# Altium project PCB_Project.PrjPcb
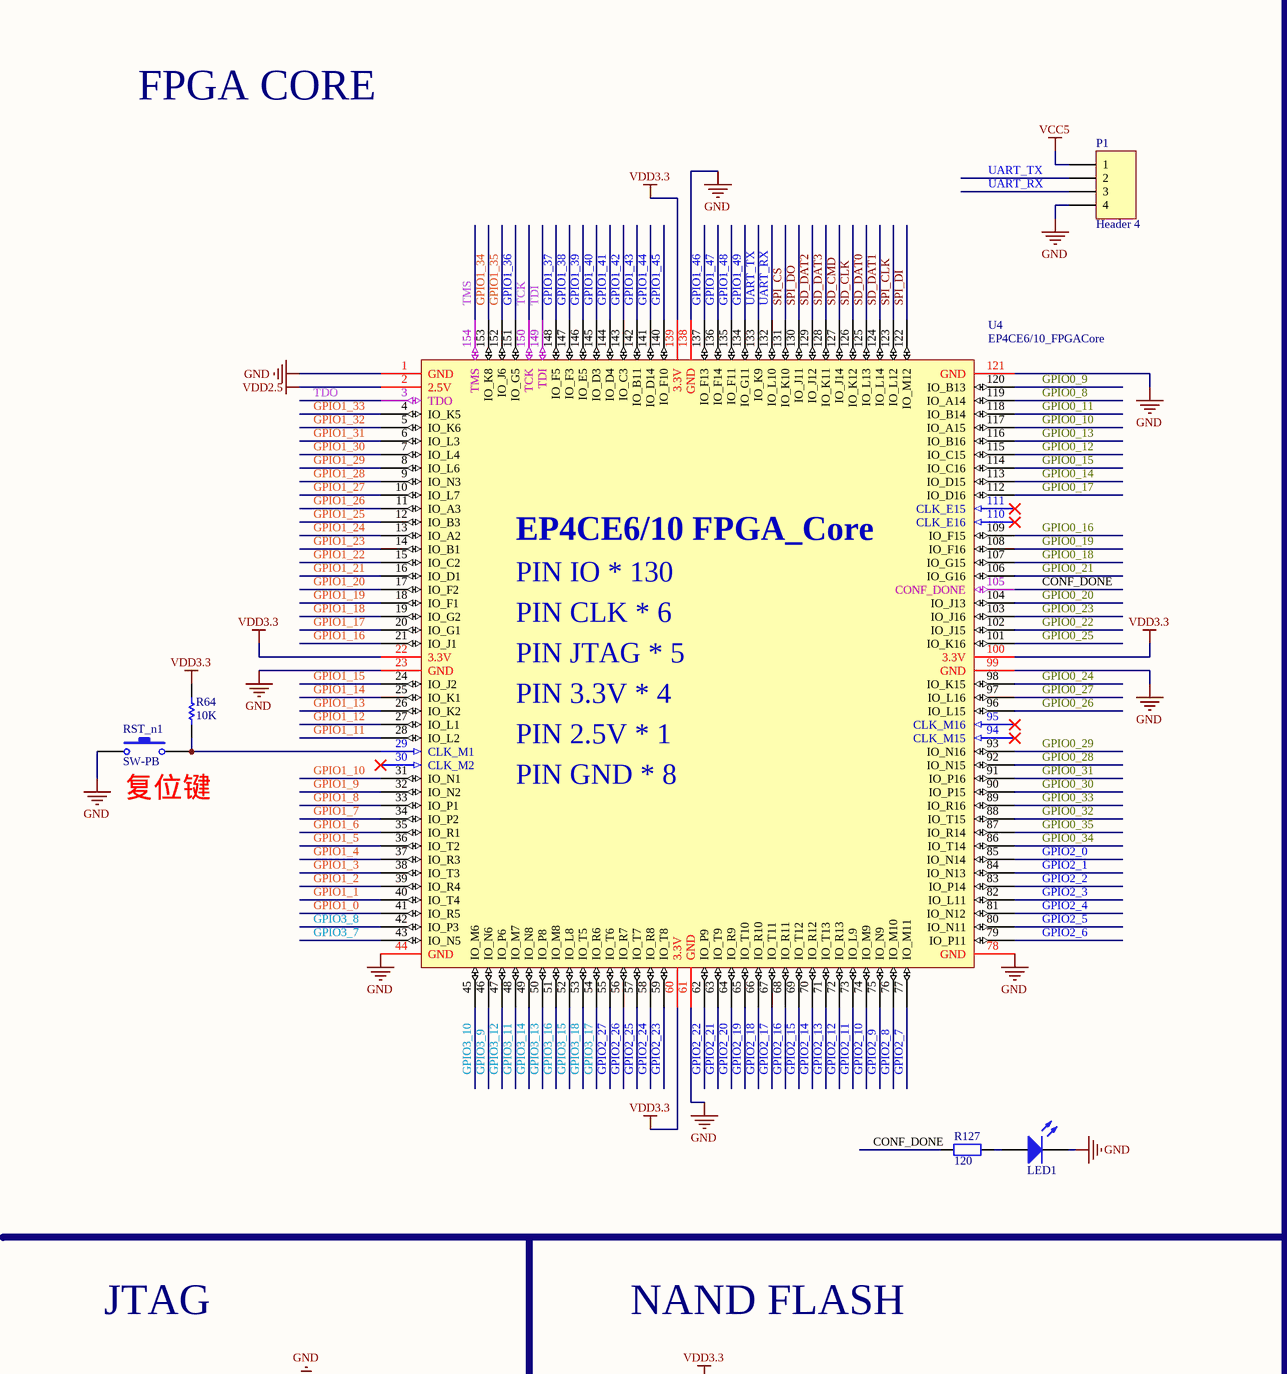
[diagram p0: i386.SchDoc, top left]
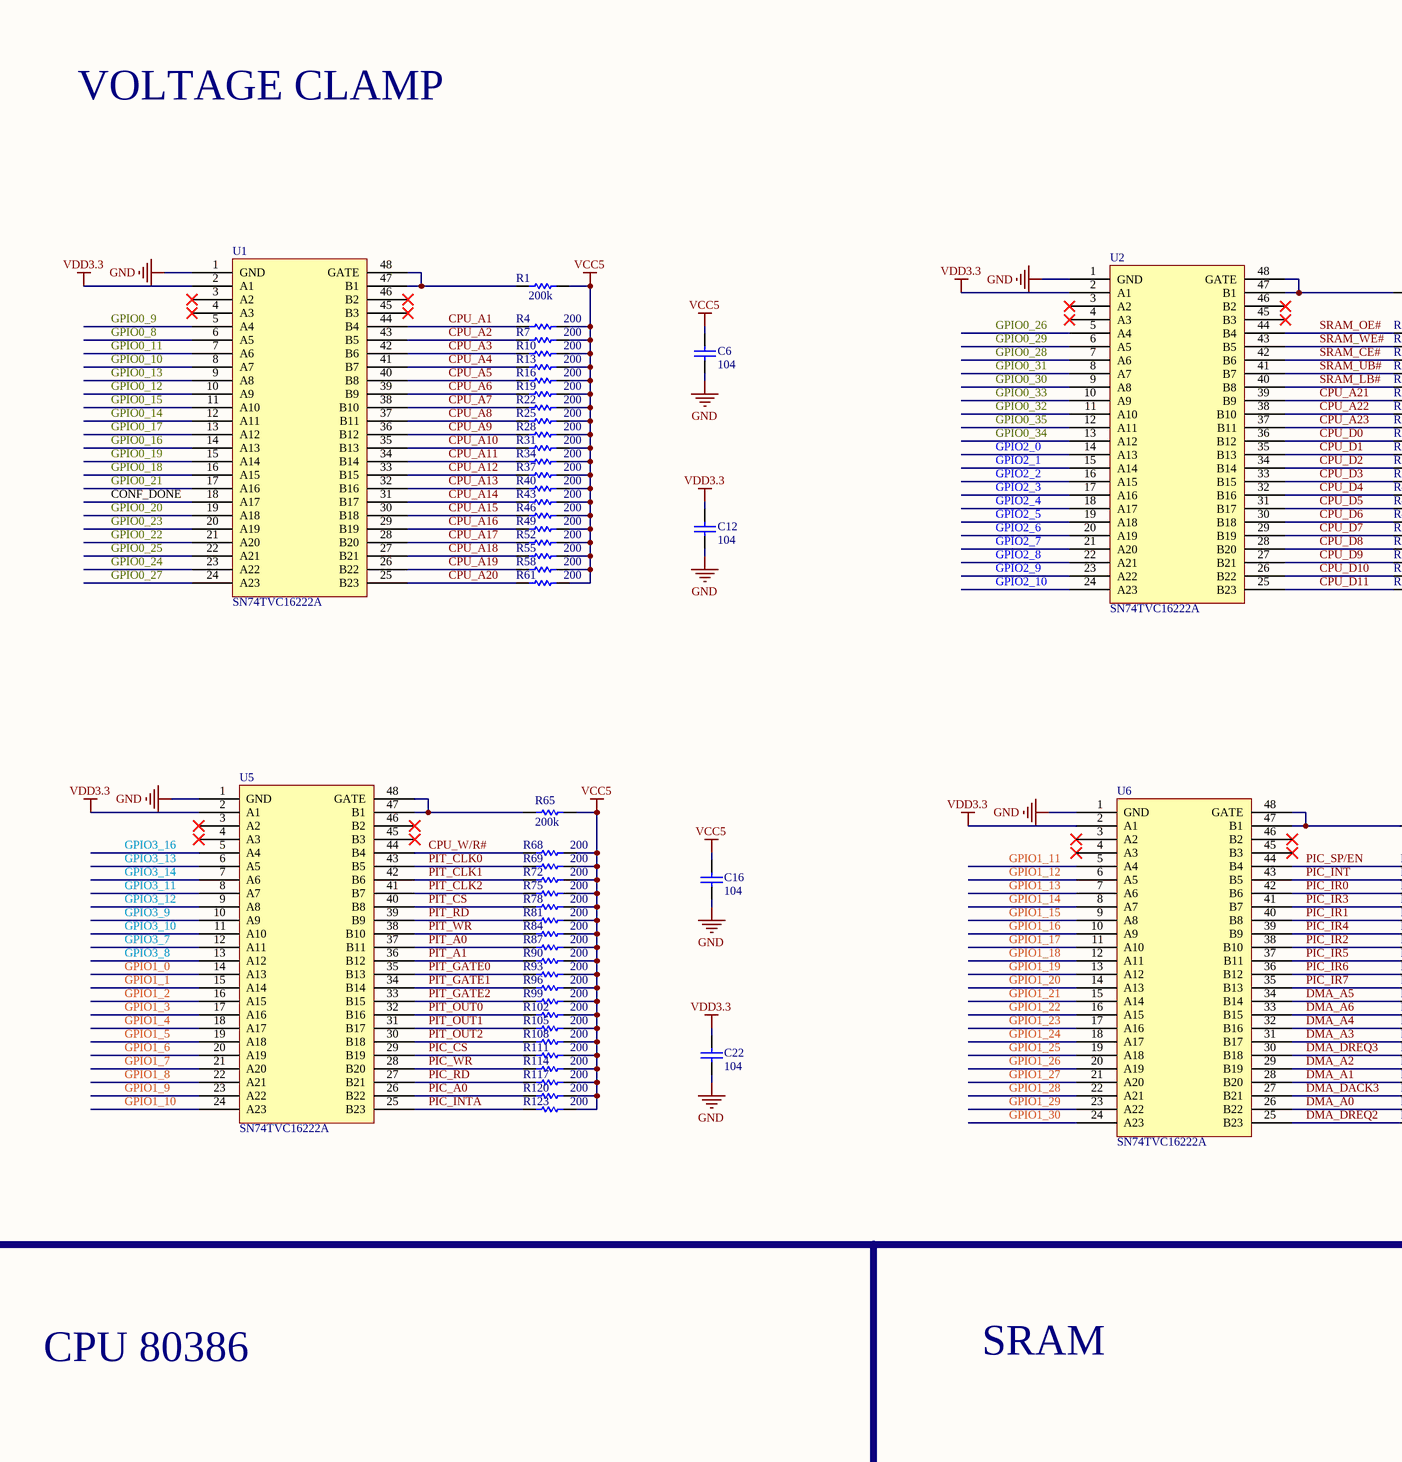
[diagram p1: i386.SchDoc, top middle]
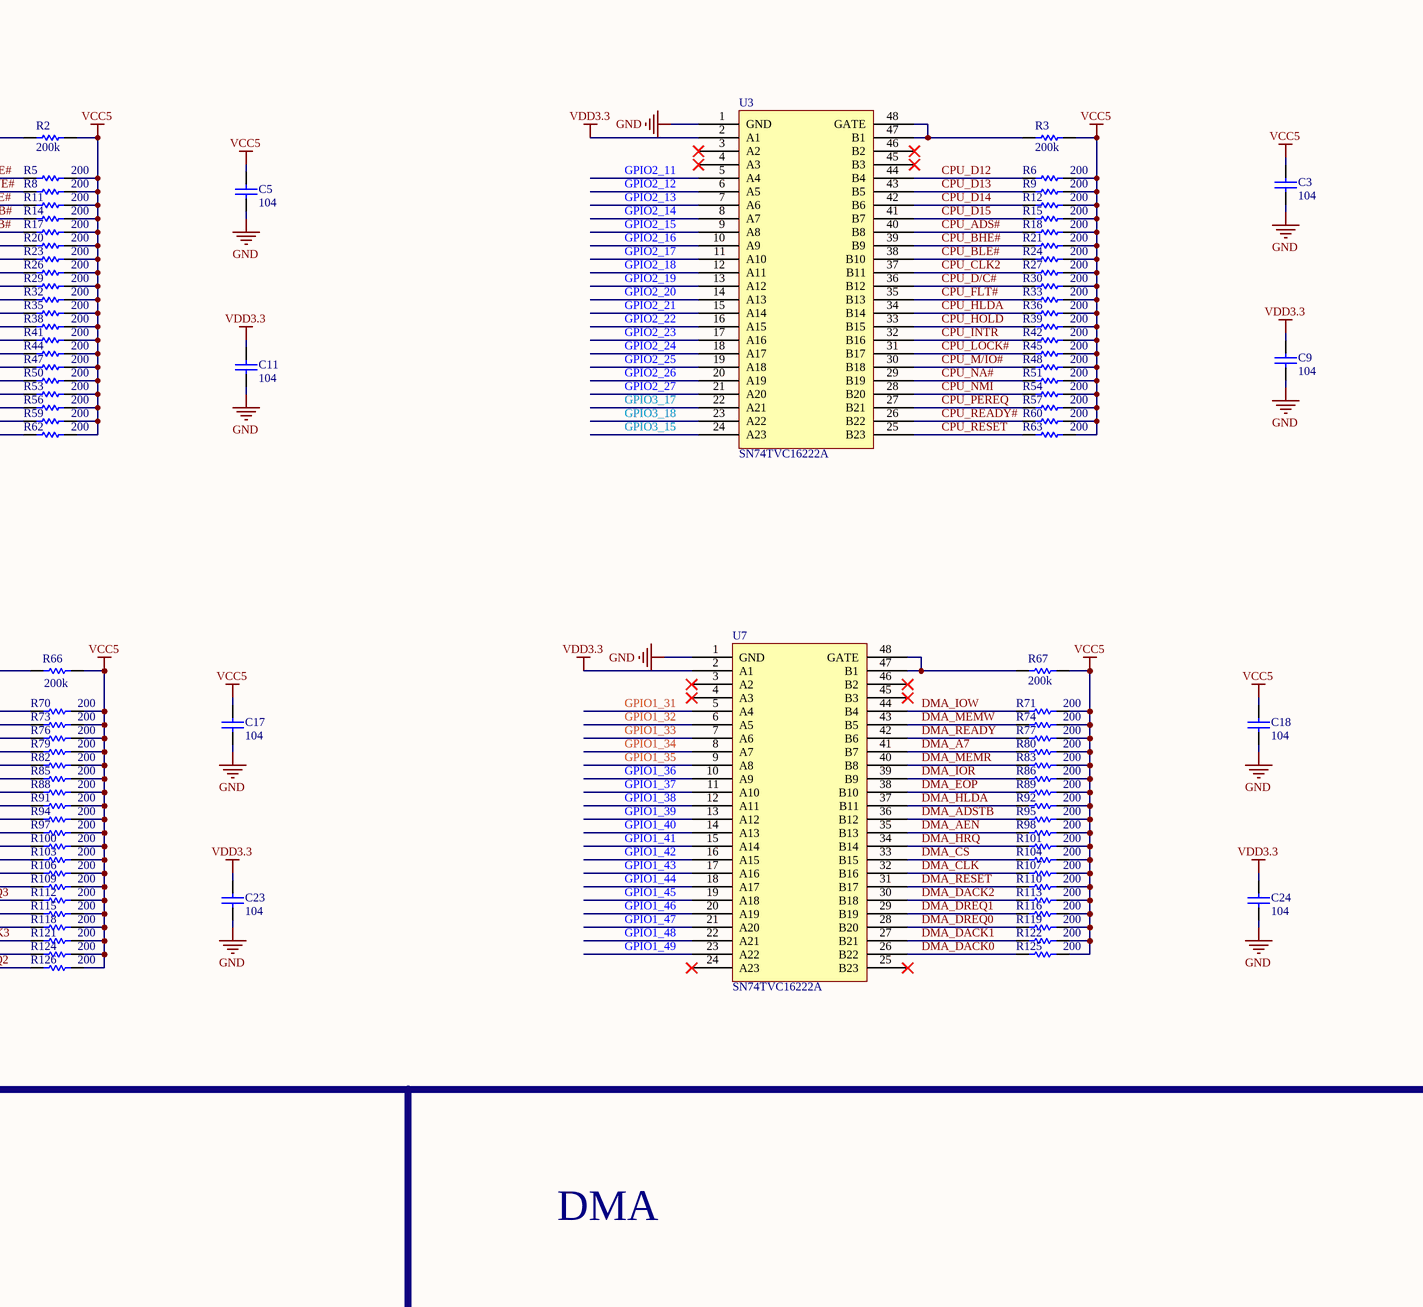
[diagram p2: i386.SchDoc, top right]
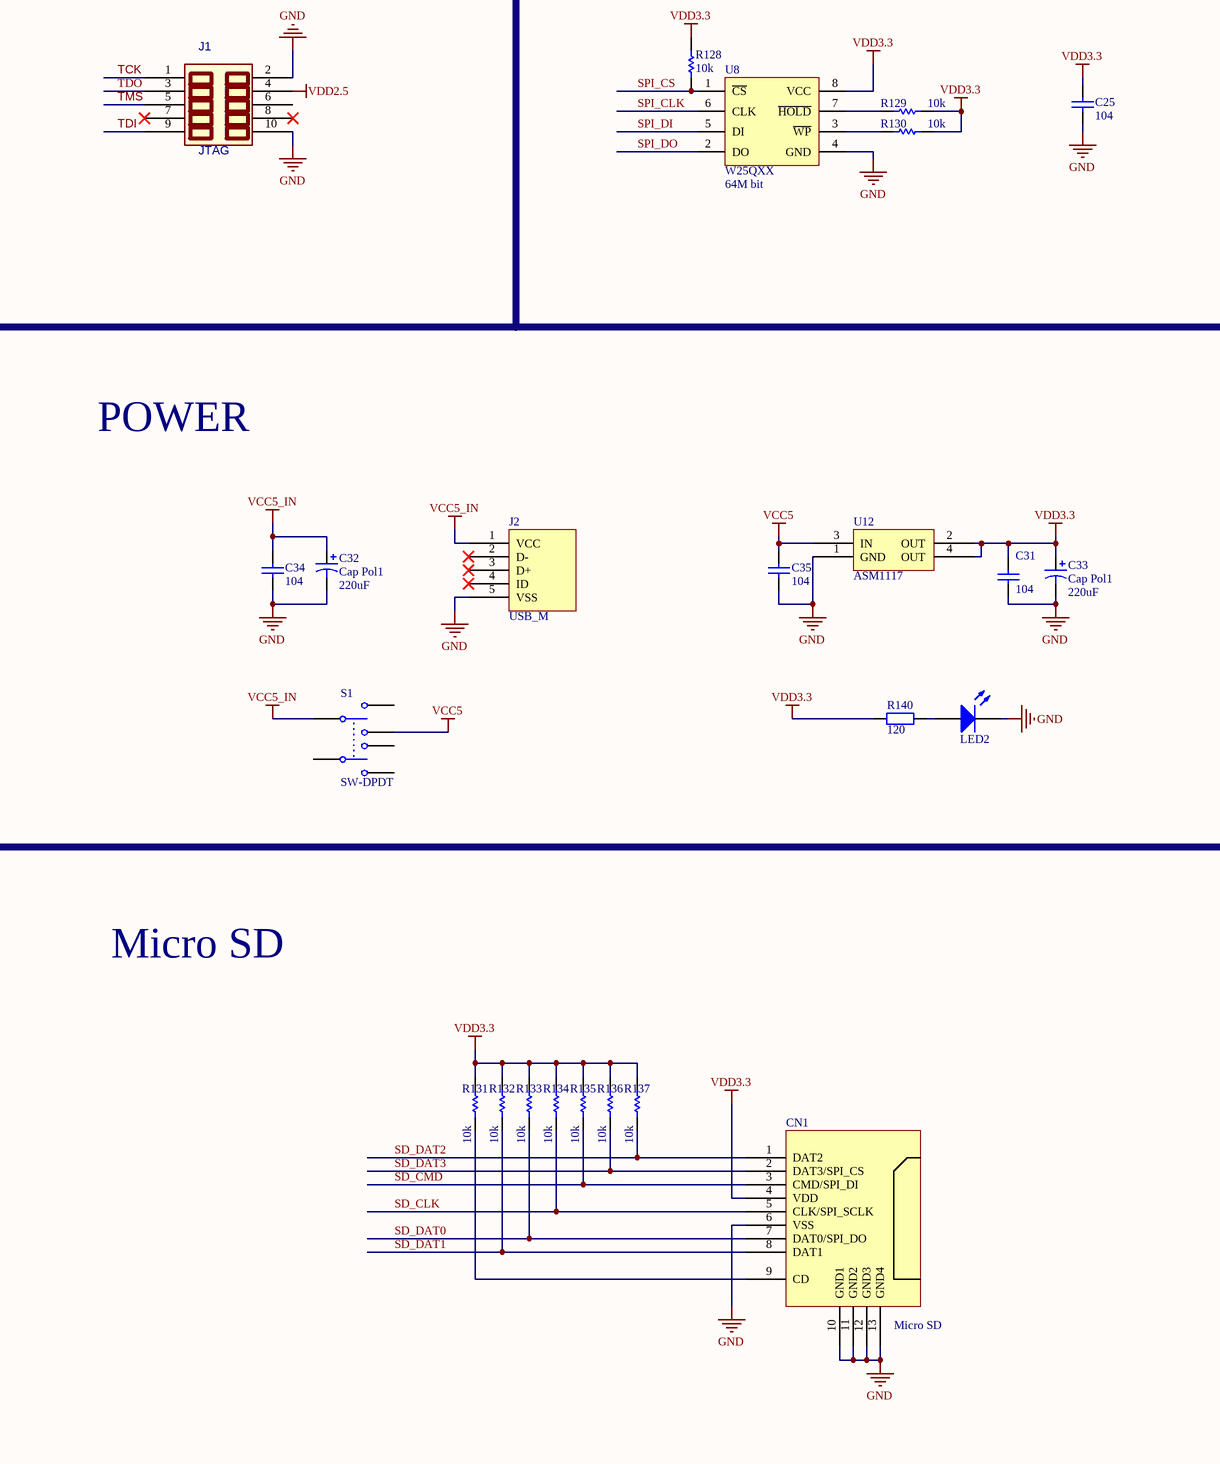
[diagram p3: i386.SchDoc, bottom left]
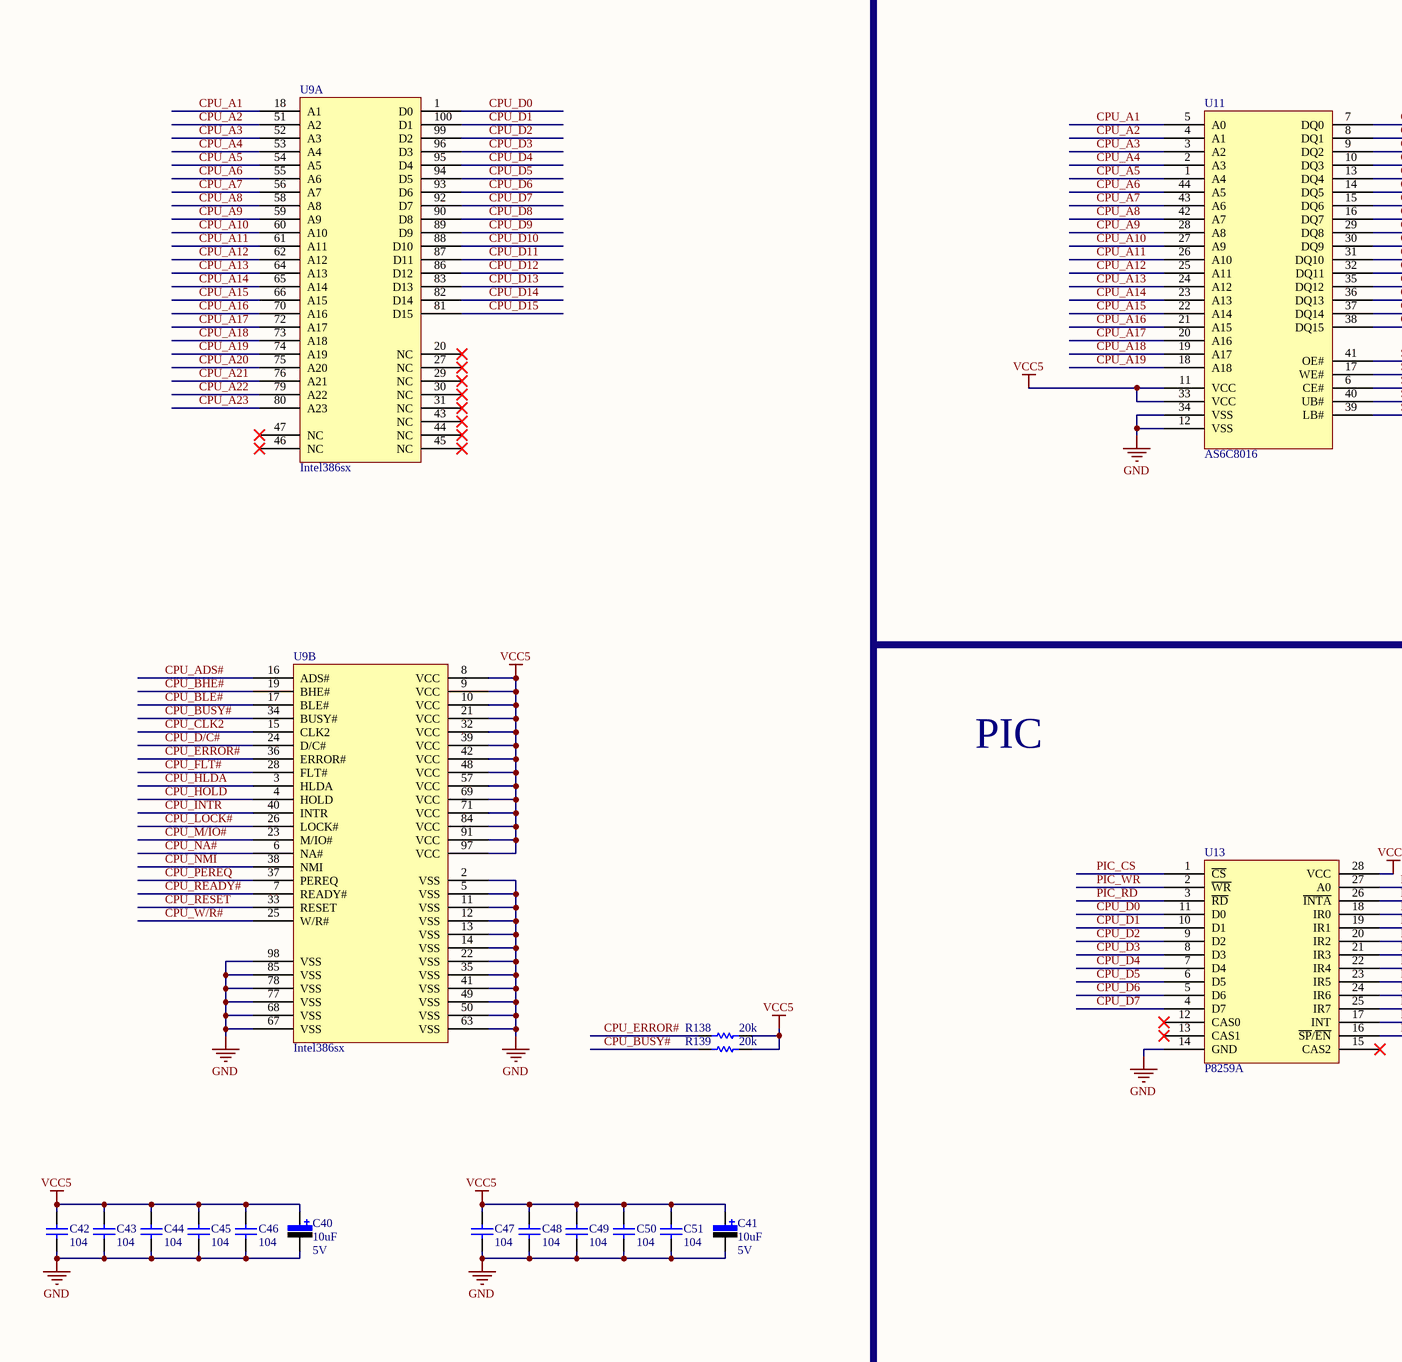
[diagram p4: i386.SchDoc, bottom middle]
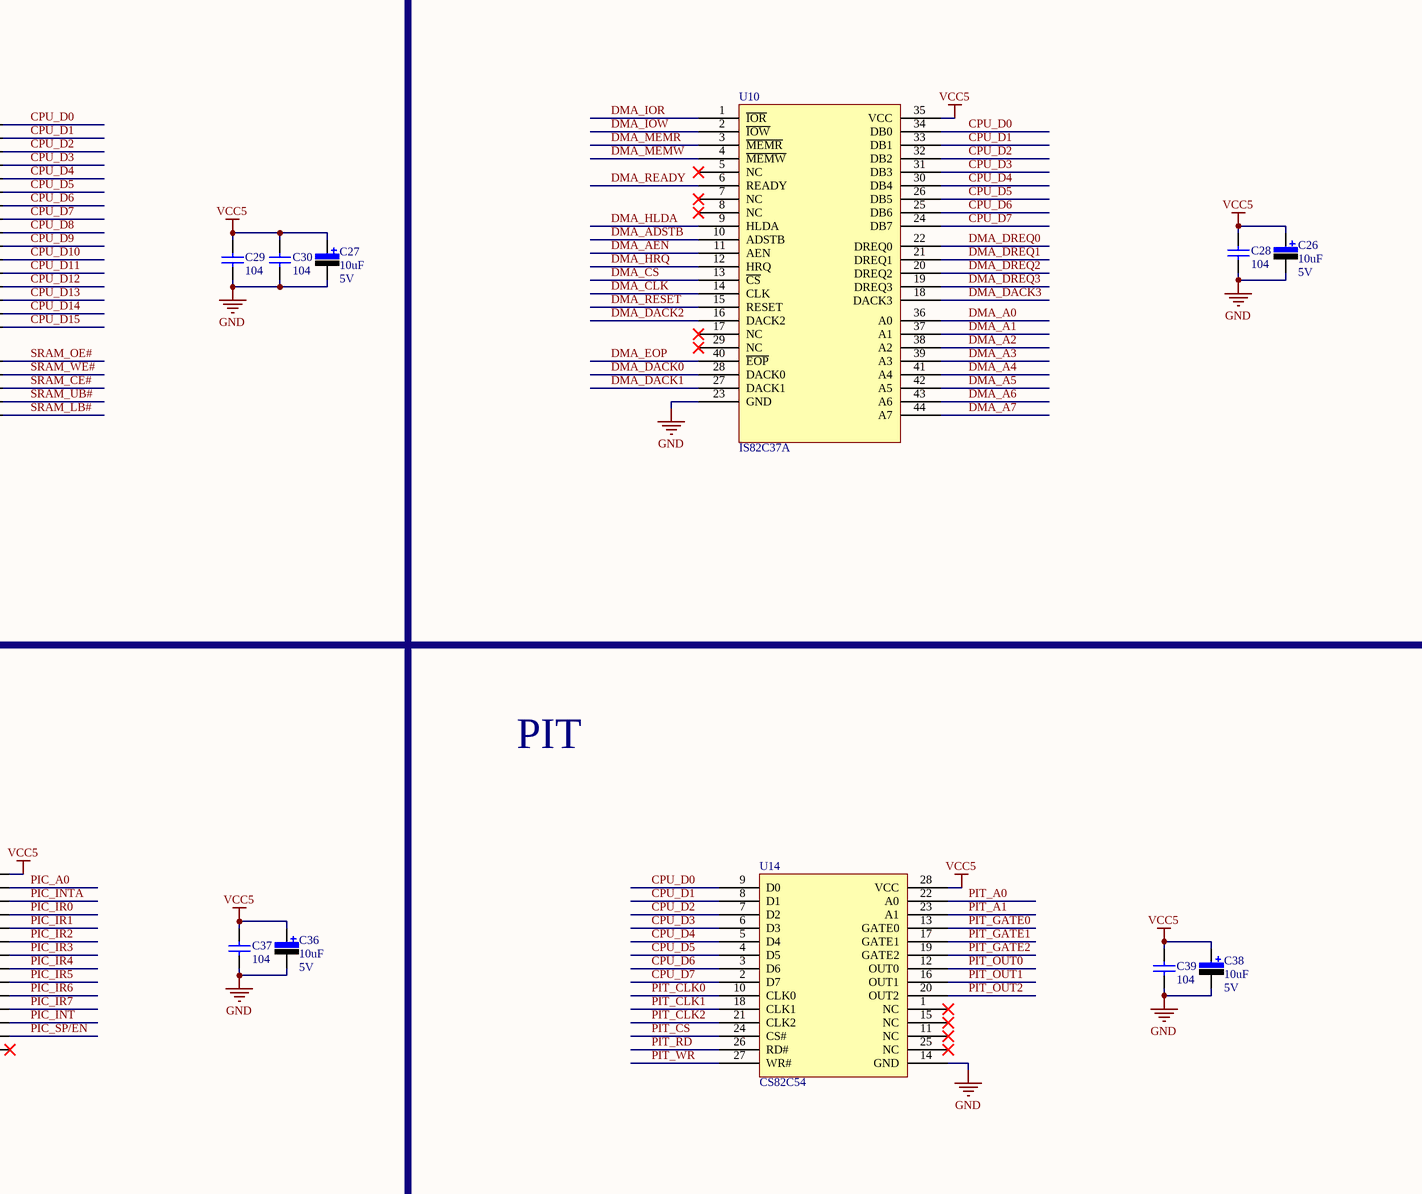
[diagram p5: i386.SchDoc, bottom right]
1 sheet, 201 parts. Net scope: global (net labels, ports and power ports of the same name join across sheets).
Board file: PCB1.PcbDoc

## Sheet i386.SchDoc
size A1

### Parts
C3  104  [C0805]
C5  104  [C0805]
C6  104  [C0805]
C9  104  [C0805]
C11  104  [C0805]
C12  104  [C0805]
C16  104  [C0805]
C17  104  [C0805]
C18  104  [C0805]
C22  104  [C0805]
C23  104  [C0805]
C24  104  [C0805]
C25  104  [C0805]
C26  value 10uF  Vol: 5V  [CAP-3528]  (hidden comment: Cap Pol)
C27  value 10uF  Vol: 5V  [CAP-3528]  (hidden comment: Cap Pol)
C28  104  [C0805]
C29  104  [C0805]
C30  104  [C0805]
C31  104  [C0805]
C32  Cap Pol1  value 220uF  [C-RB-S8]
C33  Cap Pol1  value 220uF  [C-RB-S8]
C34  104  [C0805]
C35  104  [C0805]
C36  value 10uF  Vol: 5V  [CAP-3528]  (hidden comment: Cap Pol)
C37  104  [C0805]
C38  value 10uF  Vol: 5V  [CAP-3528]  (hidden comment: Cap Pol)
C39  104  [C0805]
C40  value 10uF  Vol: 5V  [CAP-3528]  (hidden comment: Cap Pol)
C41  value 10uF  Vol: 5V  [CAP-3528]  (hidden comment: Cap Pol)
C42  104  [C0805]
C43  104  [C0805]
C44  104  [C0805]
C45  104  [C0805]
C46  104  [C0805]
C47  104  [C0805]
C48  104  [C0805]
C49  104  [C0805]
C50  104  [C0805]
C51  104  [C0805]
CN1  Micro SD  [SDCARD-M]
J1  JTAG  [HDR5X2_B1]
J2  USB_M  [USB_MICRO]
LED1  LED0  [LED-0402]  (value not drawn)
LED2  LED0  [LED-0402]  (value not drawn)
P1  Header 4  [HDR1X4]
R1  value 200k  [0402]  (hidden comment: Res1)
R2  value 200k  [0402]  (hidden comment: Res1)
R3  value 200k  [0402]  (hidden comment: Res1)
R4  value 200  [0402]  (hidden comment: Res1)
R5  value 200  [0402]  (hidden comment: Res1)
R6  value 200  [0402]  (hidden comment: Res1)
R7  value 200  [0402]  (hidden comment: Res1)
R8  value 200  [0402]  (hidden comment: Res1)
R9  value 200  [0402]  (hidden comment: Res1)
R10  value 200  [0402]  (hidden comment: Res1)
R11  value 200  [0402]  (hidden comment: Res1)
R12  value 200  [0402]  (hidden comment: Res1)
R13  value 200  [0402]  (hidden comment: Res1)
R14  value 200  [0402]  (hidden comment: Res1)
R15  value 200  [0402]  (hidden comment: Res1)
R16  value 200  [0402]  (hidden comment: Res1)
R17  value 200  [0402]  (hidden comment: Res1)
R18  value 200  [0402]  (hidden comment: Res1)
R19  value 200  [0402]  (hidden comment: Res1)
R20  value 200  [0402]  (hidden comment: Res1)
R21  value 200  [0402]  (hidden comment: Res1)
R22  value 200  [0402]  (hidden comment: Res1)
R23  value 200  [0402]  (hidden comment: Res1)
R24  value 200  [0402]  (hidden comment: Res1)
R25  value 200  [0402]  (hidden comment: Res1)
R26  value 200  [0402]  (hidden comment: Res1)
R27  value 200  [0402]  (hidden comment: Res1)
R28  value 200  [0402]  (hidden comment: Res1)
R29  value 200  [0402]  (hidden comment: Res1)
R30  value 200  [0402]  (hidden comment: Res1)
R31  value 200  [0402]  (hidden comment: Res1)
R32  value 200  [0402]  (hidden comment: Res1)
R33  value 200  [0402]  (hidden comment: Res1)
R34  value 200  [0402]  (hidden comment: Res1)
R35  value 200  [0402]  (hidden comment: Res1)
R36  value 200  [0402]  (hidden comment: Res1)
R37  value 200  [0402]  (hidden comment: Res1)
R38  value 200  [0402]  (hidden comment: Res1)
R39  value 200  [0402]  (hidden comment: Res1)
R40  value 200  [0402]  (hidden comment: Res1)
R41  value 200  [0402]  (hidden comment: Res1)
R42  value 200  [0402]  (hidden comment: Res1)
R43  value 200  [0402]  (hidden comment: Res1)
R44  value 200  [0402]  (hidden comment: Res1)
R45  value 200  [0402]  (hidden comment: Res1)
R46  value 200  [0402]  (hidden comment: Res1)
R47  value 200  [0402]  (hidden comment: Res1)
R48  value 200  [0402]  (hidden comment: Res1)
R49  value 200  [0402]  (hidden comment: Res1)
R50  value 200  [0402]  (hidden comment: Res1)
R51  value 200  [0402]  (hidden comment: Res1)
R52  value 200  [0402]  (hidden comment: Res1)
R53  value 200  [0402]  (hidden comment: Res1)
R54  value 200  [0402]  (hidden comment: Res1)
R55  value 200  [0402]  (hidden comment: Res1)
R56  value 200  [0402]  (hidden comment: Res1)
R57  value 200  [0402]  (hidden comment: Res1)
R58  value 200  [0402]  (hidden comment: Res1)
R59  value 200  [0402]  (hidden comment: Res1)
R60  value 200  [0402]  (hidden comment: Res1)
R61  value 200  [0402]  (hidden comment: Res1)
R62  value 200  [0402]  (hidden comment: Res1)
R63  value 200  [0402]  (hidden comment: Res1)
R64  value 10K  [0402]
R65  value 200k  [0402]  (hidden comment: Res1)
R66  value 200k  [0402]  (hidden comment: Res1)
R67  value 200k  [0402]  (hidden comment: Res1)
R68  value 200  [0402]  (hidden comment: Res1)
R69  value 200  [0402]  (hidden comment: Res1)
R70  value 200  [0402]  (hidden comment: Res1)
R71  value 200  [0402]  (hidden comment: Res1)
R72  value 200  [0402]  (hidden comment: Res1)
R73  value 200  [0402]  (hidden comment: Res1)
R74  value 200  [0402]  (hidden comment: Res1)
R75  value 200  [0402]  (hidden comment: Res1)
R76  value 200  [0402]  (hidden comment: Res1)
R77  value 200  [0402]  (hidden comment: Res1)
R78  value 200  [0402]  (hidden comment: Res1)
R79  value 200  [0402]  (hidden comment: Res1)
R80  value 200  [0402]  (hidden comment: Res1)
R81  value 200  [0402]  (hidden comment: Res1)
R82  value 200  [0402]  (hidden comment: Res1)
R83  value 200  [0402]  (hidden comment: Res1)
R84  value 200  [0402]  (hidden comment: Res1)
R85  value 200  [0402]  (hidden comment: Res1)
R86  value 200  [0402]  (hidden comment: Res1)
R87  value 200  [0402]  (hidden comment: Res1)
R88  value 200  [0402]  (hidden comment: Res1)
R89  value 200  [0402]  (hidden comment: Res1)
R90  value 200  [0402]  (hidden comment: Res1)
R91  value 200  [0402]  (hidden comment: Res1)
R92  value 200  [0402]  (hidden comment: Res1)
R93  value 200  [0402]  (hidden comment: Res1)
R94  value 200  [0402]  (hidden comment: Res1)
R95  value 200  [0402]  (hidden comment: Res1)
R96  value 200  [0402]  (hidden comment: Res1)
R97  value 200  [0402]  (hidden comment: Res1)
R98  value 200  [0402]  (hidden comment: Res1)
R99  value 200  [0402]  (hidden comment: Res1)
R100  value 200  [0402]  (hidden comment: Res1)
R101  value 200  [0402]  (hidden comment: Res1)
R102  value 200  [0402]  (hidden comment: Res1)
R103  value 200  [0402]  (hidden comment: Res1)
R104  value 200  [0402]  (hidden comment: Res1)
R105  value 200  [0402]  (hidden comment: Res1)
R106  value 200  [0402]  (hidden comment: Res1)
R107  value 200  [0402]  (hidden comment: Res1)
R108  value 200  [0402]  (hidden comment: Res1)
R109  value 200  [0402]  (hidden comment: Res1)
R110  value 200  [0402]  (hidden comment: Res1)
R111  value 200  [0402]  (hidden comment: Res1)
R112  value 200  [0402]  (hidden comment: Res1)
R113  value 200  [0402]  (hidden comment: Res1)
R114  value 200  [0402]  (hidden comment: Res1)
R115  value 200  [0402]  (hidden comment: Res1)
R116  value 200  [0402]  (hidden comment: Res1)
R117  value 200  [0402]  (hidden comment: Res1)
R118  value 200  [0402]  (hidden comment: Res1)
R119  value 200  [0402]  (hidden comment: Res1)
R120  value 200  [0402]  (hidden comment: Res1)
R121  value 200  [0402]  (hidden comment: Res1)
R122  value 200  [0402]  (hidden comment: Res1)
R123  value 200  [0402]  (hidden comment: Res1)
R124  value 200  [0402]  (hidden comment: Res1)
R125  value 200  [0402]  (hidden comment: Res1)
R126  value 200  [0402]  (hidden comment: Res1)
R127  value 120  [0402]  (hidden comment: Res1)
R128  value 10k  [0402]  (hidden comment: Res1)
R129  value 10k  [0402]  (hidden comment: Res1)
R130  value 10k  [0402]  (hidden comment: Res1)
R131  value 10k  [0402]  (hidden comment: Res1)
R132  value 10k  [0402]  (hidden comment: Res1)
R133  value 10k  [0402]  (hidden comment: Res1)
R134  value 10k  [0402]  (hidden comment: Res1)
R135  value 10k  [0402]  (hidden comment: Res1)
R136  value 10k  [0402]  (hidden comment: Res1)
R137  value 10k  [0402]  (hidden comment: Res1)
R138  value 20k  [0402]  (hidden comment: Res1)
R139  value 20k  [0402]  (hidden comment: Res1)
R140  value 120  [0402]  (hidden comment: Res1)
RST_n1  SW-PB  [SPST-2]
S1  SW-DPDT  [DPDT-6]
U1  SN74TVC16222A  [TSSOP50P810X120-48N]
U2  SN74TVC16222A  [TSSOP50P810X120-48N]
U3  SN74TVC16222A  [TSSOP50P810X120-48N]
U4  EP4CE6/10_FPGACore  [EP4CE6/10_FPGACore]
U5  SN74TVC16222A  [TSSOP50P810X120-48N]
U6  SN74TVC16222A  [TSSOP50P810X120-48N]
U7  SN74TVC16222A  [TSSOP50P810X120-48N]
U8  W25QXX  Memory: 64M bit  [SOIC8_W]
U9  Intel386sx  [BQFP-i386-SX]  (parts A,B of 2)
U10  IS82C37A  [PLCC-44-IC-SOCKET]
U11  AS6C8016  [TSOP80P1160X120-44N]
U12  ASM1117  [SOT-223]
U13  P8259A  [DIP28]
U14  CS82C54  [PLCC-28-IC-SOCKET]

### Nets
GND: C3.2 C5.2 C6.2 C9.2 C11.2 C12.2 C16.2 C17.2 C18.2 C22.2 C23.2 C24.2 C25.1 C26.2 C27.2 C28.2 C29.2 C30.2 C31.1 C32.2 C33.2 C34.1 C35.1 C36.2 C37.2 C38.2 C39.2 C40.2 C41.2 C42.2 C43.2 C44.2 C45.2 C46.2 C47.2 C48.2 C49.2 C50.2 C51.2 CN1.6(VSS) CN1.10(GND1) CN1.11(GND2) CN1.12(GND3) CN1.13(GND4) J1.2 J1.10 J2.5(VSS) LED1.2(K) LED2.2(K) P1.4 RST_n1.1 U1.1(GND) U2.1(GND) U3.1(GND) U4.1(GND) U4.23(GND) U4.44(GND) U4.61(GND) U4.78(GND) U4.99(GND) U4.121(GND) U4.138(GND) U5.1(GND) U6.1(GND) U7.1(GND) U8.4(GND) U9.2(VSS) U9.5(VSS) U9.11(VSS) U9.12(VSS) U9.13(VSS) U9.14(VSS) U9.22(VSS) U9.35(VSS) U9.41(VSS) U9.49(VSS) U9.50(VSS) U9.63(VSS) U9.67(VSS) U9.68(VSS) U9.77(VSS) U9.78(VSS) U9.85(VSS) U9.98(VSS) U10.23(GND) U11.12(VSS) U11.34(VSS) U12.1(GND) U13.14(GND) U14.14(GND)
VCC5: C3.1 C5.1 C6.1 C16.1 C17.1 C18.1 C26.1 C27.1 C28.1 C29.1 C30.1 C35.2 C36.1 C37.1 C38.1 C39.1 C40.1 C41.1 C42.1 C43.1 C44.1 C45.1 C46.1 C47.1 C48.1 C49.1 C50.1 C51.1 P1.1 R1.2 R2.2 R3.2 R4.2 R5.2 R6.2 R7.2 R8.2 R9.2 R10.2 R11.2 R12.2 R13.2 R14.2 R15.2 R16.2 R17.2 R18.2 R19.2 R20.2 R21.2 R22.2 R23.2 R24.2 R25.2 R26.2 R27.2 R28.2 R29.2 R30.2 R31.2 R32.2 R33.2 R34.2 R35.2 R36.2 R37.2 R38.2 R39.2 R40.2 R41.2 R42.2 R43.2 R44.2 R45.2 R46.2 R47.2 R48.2 R49.2 R50.2 R51.2 R52.2 R53.2 R54.2 R55.2 R56.2 R57.2 R58.2 R59.2 R60.2 R61.2 R62.2 R63.2 R65.2 R66.2 R67.2 R68.2 R69.2 R70.2 R71.2 R72.2 R73.2 R74.2 R75.2 R76.2 R77.2 R78.2 R79.2 R80.2 R81.2 R82.2 R83.2 R84.2 R85.2 R86.2 R87.2 R88.2 R89.2 R90.2 R91.2 R92.2 R93.2 R94.2 R95.2 R96.2 R97.2 R98.2 R99.2 R100.2 R101.2 R102.2 R103.2 R104.2 R105.2 R106.2 R107.2 R108.2 R109.2 R110.2 R111.2 R112.2 R113.2 R114.2 R115.2 R116.2 R117.2 R118.2 R119.2 R120.2 R121.2 R122.2 R123.2 R124.2 R125.2 R126.2 R138.2 R139.2 S1.3 U9.8(VCC) U9.9(VCC) U9.10(VCC) U9.21(VCC) U9.32(VCC) U9.39(VCC) U9.42(VCC) U9.48(VCC) U9.57(VCC) U9.69(VCC) U9.71(VCC) U9.84(VCC) U9.91(VCC) U9.97(VCC) U10.35(VCC) U11.11(VCC) U11.33(VCC) U12.3(IN) U13.28(VCC) U14.28(VCC)
VCC5_IN: C32.1 C34.2 J2.1(VCC) S1.1
VDD2.5: J1.4 U4.2(2.5V)
VDD3.3: C9.1 C11.1 C12.1 C22.1 C23.1 C24.1 C25.2 C31.2 C33.1 CN1.4(VDD) R64.2 R128.2 R129.2 R130.2 R131.2 R132.2 R133.2 R134.2 R135.2 R136.2 R137.2 R140.1 U1.2(A1) U2.2(A1) U3.2(A1) U4.22(3.3V) U4.60(3.3V) U4.100(3.3V) U4.139(3.3V) U5.2(A1) U6.2(A1) U7.2(A1) U8.8(VCC) U12.2(OUT) U12.4(OUT)
CONF_DONE: R127.1 U1.18(A17) U4.105(CONF_DONE)
CPU_A1: R4.1 U1.44(B4) U9.18(A1) U11.5(A0)
CPU_A2: R7.1 U1.43(B5) U9.51(A2) U11.4(A1)
CPU_A3: R10.1 U1.42(B6) U9.52(A3) U11.3(A2)
CPU_A4: R13.1 U1.41(B7) U9.53(A4) U11.2(A3)
CPU_A5: R16.1 U1.40(B8) U9.54(A5) U11.1(A4)
CPU_A6: R19.1 U1.39(B9) U9.55(A6) U11.44(A5)
CPU_A7: R22.1 U1.38(B10) U9.56(A7) U11.43(A6)
CPU_A8: R25.1 U1.37(B11) U9.58(A8) U11.42(A7)
CPU_A9: R28.1 U1.36(B12) U9.59(A9) U11.28(A8)
CPU_A10: R31.1 U1.35(B13) U9.60(A10) U11.27(A9)
CPU_A11: R34.1 U1.34(B14) U9.61(A11) U11.26(A10)
CPU_A12: R37.1 U1.33(B15) U9.62(A12) U11.25(A11)
CPU_A13: R40.1 U1.32(B16) U9.64(A13) U11.24(A12)
CPU_A14: R43.1 U1.31(B17) U9.65(A14) U11.23(A13)
CPU_A15: R46.1 U1.30(B18) U9.66(A15) U11.22(A14)
CPU_A16: R49.1 U1.29(B19) U9.70(A16) U11.21(A15)
CPU_A17: R52.1 U1.28(B20) U9.72(A17) U11.20(A16)
CPU_A18: R55.1 U1.27(B21) U9.73(A18) U11.19(A17)
CPU_A19: R58.1 U1.26(B22) U9.74(A19) U11.18(A18)
CPU_A20: R61.1 U1.25(B23) U9.75(A20)
CPU_A21: R20.1 U2.39(B9) U9.76(A21)
CPU_A22: R23.1 U2.38(B10) U9.79(A22)
CPU_A23: R26.1 U2.37(B11) U9.80(A23)
CPU_ADS#: R18.1 U3.40(B8) U9.16(ADS#)
CPU_BHE#: R21.1 U3.39(B9) U9.19(BHE#)
CPU_BLE#: R24.1 U3.38(B10) U9.17(BLE#)
CPU_BUSY#: R139.1 U9.34(BUSY#)
CPU_CLK2: R27.1 U3.37(B11) U9.15(CLK2)
CPU_D0: R29.1 U2.36(B12) U9.1(D0) U10.34(DB0) U11.7(DQ0) U13.11(D0) U14.9(D0)
CPU_D1: R32.1 U2.35(B13) U9.100(D1) U10.33(DB1) U11.8(DQ1) U13.10(D1) U14.8(D1)
CPU_D2: R35.1 U2.34(B14) U9.99(D2) U10.32(DB2) U11.9(DQ2) U13.9(D2) U14.7(D2)
CPU_D3: R38.1 U2.33(B15) U9.96(D3) U10.31(DB3) U11.10(DQ3) U13.8(D3) U14.6(D3)
CPU_D4: R41.1 U2.32(B16) U9.95(D4) U10.30(DB4) U11.13(DQ4) U13.7(D4) U14.5(D4)
CPU_D5: R44.1 U2.31(B17) U9.94(D5) U10.26(DB5) U11.14(DQ5) U13.6(D5) U14.4(D5)
CPU_D6: R47.1 U2.30(B18) U9.93(D6) U10.25(DB6) U11.15(DQ6) U13.5(D6) U14.3(D6)
CPU_D7: R50.1 U2.29(B19) U9.92(D7) U10.24(DB7) U11.16(DQ7) U13.4(D7) U14.2(D7)
CPU_D8: R53.1 U2.28(B20) U9.90(D8) U11.29(DQ8)
CPU_D9: R56.1 U2.27(B21) U9.89(D9) U11.30(DQ9)
CPU_D10: R59.1 U2.26(B22) U9.88(D10) U11.31(DQ10)
CPU_D11: R62.1 U2.25(B23) U9.87(D11) U11.32(DQ11)
CPU_D12: R6.1 U3.44(B4) U9.86(D12) U11.35(DQ12)
CPU_D13: R9.1 U3.43(B5) U9.83(D13) U11.36(DQ13)
CPU_D14: R12.1 U3.42(B6) U9.82(D14) U11.37(DQ14)
CPU_D15: R15.1 U3.41(B7) U9.81(D15) U11.38(DQ15)
CPU_D/C#: R30.1 U3.36(B12) U9.24(D/C#)
CPU_ERROR#: R138.1 U9.36(ERROR#)
CPU_FLT#: R33.1 U3.35(B13) U9.28(FLT#)
CPU_HLDA: R36.1 U3.34(B14) U9.3(HLDA)
CPU_HOLD: R39.1 U3.33(B15) U9.4(HOLD)
CPU_INTR: R42.1 U3.32(B16) U9.40(INTR)
CPU_LOCK#: R45.1 U3.31(B17) U9.26(LOCK#)
CPU_M/IO#: R48.1 U3.30(B18) U9.23(M/IO#)
CPU_NA#: R51.1 U3.29(B19) U9.6(NA#)
CPU_NMI: R54.1 U3.28(B20) U9.38(NMI)
CPU_PEREQ: R57.1 U3.27(B21) U9.37(PEREQ)
CPU_READY#: R60.1 U3.26(B22) U9.7(READY#)
CPU_RESET: R63.1 U3.25(B23) U9.33(RESET)
CPU_W/R#: R68.1 U5.44(B4) U9.25(W/R#)
DMA_A0: R124.1 U6.26(B22) U10.36(A0)
DMA_A1: R118.1 U6.28(B20) U10.37(A1)
DMA_A2: R115.1 U6.29(B19) U10.38(A2)
DMA_A3: R109.1 U6.31(B17) U10.39(A3)
DMA_A4: R106.1 U6.32(B16) U10.41(A4)
DMA_A5: R100.1 U6.34(B14) U10.42(A5)
DMA_A6: R103.1 U6.33(B15) U10.43(A6)
DMA_A7: R80.1 U7.41(B7) U10.44(A7)
DMA_ADSTB: R95.1 U7.36(B12) U10.10(ADSTB)
DMA_AEN: R98.1 U7.35(B13) U10.11(AEN)
DMA_CLK: R107.1 U7.32(B16) U10.14(CLK)
DMA_CS: R104.1 U7.33(B15) U10.13(~{CS})
DMA_DACK0: R125.1 U7.26(B22) U10.28(DACK0)
DMA_DACK1: R122.1 U7.27(B21) U10.27(DACK1)
DMA_DACK2: R113.1 U7.30(B18) U10.16(DACK2)
DMA_DACK3: R121.1 U6.27(B21) U10.18(DACK3)
DMA_DREQ0: R119.1 U7.28(B20) U10.22(DREQ0)
DMA_DREQ1: R116.1 U7.29(B19) U10.21(DREQ1)
DMA_DREQ2: R126.1 U6.25(B23) U10.20(DREQ2)
DMA_DREQ3: R112.1 U6.30(B18) U10.19(DREQ3)
DMA_EOP: R89.1 U7.38(B10) U10.40(~{EOP})
DMA_HLDA: R92.1 U7.37(B11) U10.9(HLDA)
DMA_HRQ: R101.1 U7.34(B14) U10.12(HRQ)
DMA_IOR: R86.1 U7.39(B9) U10.1(~{IOR})
DMA_IOW: R71.1 U7.44(B4) U10.2(~{IOW})
DMA_MEMR: R83.1 U7.40(B8) U10.3(~{MEMR})
DMA_MEMW: R74.1 U7.43(B5) U10.4(~{MEMW})
DMA_READY: R77.1 U7.42(B6) U10.6(READY)
DMA_RESET: R110.1 U7.31(B17) U10.15(RESET)
GPIO0_8: U1.6(A5) U4.119(IO_A14)
GPIO0_9: U1.5(A4) U4.120(IO_B13)
GPIO0_10: U1.8(A7) U4.117(IO_A15)
GPIO0_11: U1.7(A6) U4.118(IO_B14)
GPIO0_12: U1.10(A9) U4.115(IO_C15)
GPIO0_13: U1.9(A8) U4.116(IO_B16)
GPIO0_14: U1.12(A11) U4.113(IO_D15)
GPIO0_15: U1.11(A10) U4.114(IO_C16)
GPIO0_16: U1.14(A13) U4.109(IO_F15)
GPIO0_17: U1.13(A12) U4.112(IO_D16)
GPIO0_18: U1.16(A15) U4.107(IO_G15)
GPIO0_19: U1.15(A14) U4.108(IO_F16)
GPIO0_20: U1.19(A18) U4.104(IO_J13)
GPIO0_21: U1.17(A16) U4.106(IO_G16)
GPIO0_22: U1.21(A20) U4.102(IO_J15)
GPIO0_23: U1.20(A19) U4.103(IO_J16)
GPIO0_24: U1.23(A22) U4.98(IO_K15)
GPIO0_25: U1.22(A21) U4.101(IO_K16)
GPIO0_26: U2.5(A4) U4.96(IO_L15)
GPIO0_27: U1.24(A23) U4.97(IO_L16)
GPIO0_28: U2.7(A6) U4.92(IO_N15)
GPIO0_29: U2.6(A5) U4.93(IO_N16)
GPIO0_30: U2.9(A8) U4.90(IO_P15)
GPIO0_31: U2.8(A7) U4.91(IO_P16)
GPIO0_32: U2.11(A10) U4.88(IO_T15)
GPIO0_33: U2.10(A9) U4.89(IO_R16)
GPIO0_34: U2.13(A12) U4.86(IO_T14)
GPIO0_35: U2.12(A11) U4.87(IO_R14)
GPIO1_0: U4.41(IO_R5) U5.14(A13)
GPIO1_1: U4.40(IO_T4) U5.15(A14)
GPIO1_2: U4.39(IO_R4) U5.16(A15)
GPIO1_3: U4.38(IO_T3) U5.17(A16)
GPIO1_4: U4.37(IO_R3) U5.18(A17)
GPIO1_5: U4.36(IO_T2) U5.19(A18)
GPIO1_6: U4.35(IO_R1) U5.20(A19)
GPIO1_7: U4.34(IO_P2) U5.21(A20)
GPIO1_8: U4.33(IO_P1) U5.22(A21)
GPIO1_9: U4.32(IO_N2) U5.23(A22)
GPIO1_10: U4.31(IO_N1) U5.24(A23)
GPIO1_11: U4.28(IO_L2) U6.5(A4)
GPIO1_12: U4.27(IO_L1) U6.6(A5)
GPIO1_13: U4.26(IO_K2) U6.7(A6)
GPIO1_14: U4.25(IO_K1) U6.8(A7)
GPIO1_15: U4.24(IO_J2) U6.9(A8)
GPIO1_16: U4.21(IO_J1) U6.10(A9)
GPIO1_17: U4.20(IO_G1) U6.11(A10)
GPIO1_18: U4.19(IO_G2) U6.12(A11)
GPIO1_19: U4.18(IO_F1) U6.13(A12)
GPIO1_20: U4.17(IO_F2) U6.14(A13)
GPIO1_21: U4.16(IO_D1) U6.15(A14)
GPIO1_22: U4.15(IO_C2) U6.16(A15)
GPIO1_23: U4.14(IO_B1) U6.17(A16)
GPIO1_24: U4.13(IO_A2) U6.18(A17)
GPIO1_25: U4.12(IO_B3) U6.19(A18)
GPIO1_26: U4.11(IO_A3) U6.20(A19)
GPIO1_27: U4.10(IO_L7) U6.21(A20)
GPIO1_28: U4.9(IO_N3) U6.22(A21)
GPIO1_29: U4.8(IO_L6) U6.23(A22)
GPIO1_30: U4.7(IO_L4) U6.24(A23)
GPIO1_31: U4.6(IO_L3) U7.5(A4)
GPIO1_32: U4.5(IO_K6) U7.6(A5)
GPIO1_33: U4.4(IO_K5) U7.7(A6)
GPIO1_34: U4.153(IO_K8) U7.8(A7)
GPIO1_35: U4.152(IO_J6) U7.9(A8)
GPIO1_36: U4.151(IO_G5) U7.10(A9)
GPIO1_37: U4.148(IO_F5) U7.11(A10)
GPIO1_38: U4.147(IO_F3) U7.12(A11)
GPIO1_39: U4.146(IO_E5) U7.13(A12)
GPIO1_40: U4.145(IO_D3) U7.14(A13)
GPIO1_41: U4.144(IO_D4) U7.15(A14)
GPIO1_42: U4.143(IO_C3) U7.16(A15)
GPIO1_43: U4.142(IO_B11) U7.17(A16)
GPIO1_44: U4.141(IO_D14) U7.18(A17)
GPIO1_45: U4.140(IO_F10) U7.19(A18)
GPIO1_46: U4.137(IO_F13) U7.20(A19)
GPIO1_47: U4.136(IO_F14) U7.21(A20)
GPIO1_48: U4.135(IO_F11) U7.22(A21)
GPIO1_49: U4.134(IO_G11) U7.23(A22)
GPIO2_0: U2.14(A13) U4.85(IO_N14)
GPIO2_1: U2.15(A14) U4.84(IO_N13)
GPIO2_2: U2.16(A15) U4.83(IO_P14)
GPIO2_3: U2.17(A16) U4.82(IO_L11)
GPIO2_4: U2.18(A17) U4.81(IO_N12)
GPIO2_5: U2.19(A18) U4.80(IO_N11)
GPIO2_6: U2.20(A19) U4.79(IO_P11)
GPIO2_7: U2.21(A20) U4.77(IO_M11)
GPIO2_8: U2.22(A21) U4.76(IO_M10)
GPIO2_9: U2.23(A22) U4.75(IO_N9)
GPIO2_10: U2.24(A23) U4.74(IO_M9)
GPIO2_11: U3.5(A4) U4.73(IO_L9)
GPIO2_12: U3.6(A5) U4.72(IO_R13)
GPIO2_13: U3.7(A6) U4.71(IO_T13)
GPIO2_14: U3.8(A7) U4.70(IO_R12)
GPIO2_15: U3.9(A8) U4.69(IO_T12)
GPIO2_16: U3.10(A9) U4.68(IO_R11)
GPIO2_17: U3.11(A10) U4.67(IO_T11)
GPIO2_18: U3.12(A11) U4.66(IO_R10)
GPIO2_19: U3.13(A12) U4.65(IO_T10)
GPIO2_20: U3.14(A13) U4.64(IO_R9)
GPIO2_21: U3.15(A14) U4.63(IO_T9)
GPIO2_22: U3.16(A15) U4.62(IO_P9)
GPIO2_23: U3.17(A16) U4.59(IO_T8)
GPIO2_24: U3.18(A17) U4.58(IO_R8)
GPIO2_25: U3.19(A18) U4.57(IO_T7)
GPIO2_26: U3.20(A19) U4.56(IO_R7)
GPIO2_27: U3.21(A20) U4.55(IO_T6)
GPIO3_7: U4.43(IO_N5) U5.12(A11)
GPIO3_8: U4.42(IO_P3) U5.13(A12)
GPIO3_9: U4.46(IO_N6) U5.10(A9)
GPIO3_10: U4.45(IO_M6) U5.11(A10)
GPIO3_11: U4.48(IO_M7) U5.8(A7)
GPIO3_12: U4.47(IO_P6) U5.9(A8)
GPIO3_13: U4.50(IO_P8) U5.6(A5)
GPIO3_14: U4.49(IO_N8) U5.7(A6)
GPIO3_15: U3.24(A23) U4.52(IO_L8)
GPIO3_16: U4.51(IO_M8) U5.5(A4)
GPIO3_17: U3.22(A21) U4.54(IO_R6)
GPIO3_18: U3.23(A22) U4.53(IO_T5)
PIC_A0: R120.1 U5.26(B22) U13.27(A0)
PIC_CS: R111.1 U5.29(B19) U13.1(~{CS})
PIC_INT: R73.1 U6.43(B5) U13.17(INT)
PIC_INTA: R123.1 U5.25(B23) U13.26(~{INTA})
PIC_IR0: R76.1 U6.42(B6) U13.18(IR0)
PIC_IR1: R82.1 U6.40(B8) U13.19(IR1)
PIC_IR2: R88.1 U6.38(B10) U13.20(IR2)
PIC_IR3: R79.1 U6.41(B7) U13.21(IR3)
PIC_IR4: R85.1 U6.39(B9) U13.22(IR4)
PIC_IR5: R91.1 U6.37(B11) U13.23(IR5)
PIC_IR6: R94.1 U6.36(B12) U13.24(IR6)
PIC_IR7: R97.1 U6.35(B13) U13.25(IR7)
PIC_RD: R117.1 U5.27(B21) U13.3(~{RD})
PIC_SP/EN: R70.1 U6.44(B4) U13.16(~{SP}/~{EN})
PIC_WR: R114.1 U5.28(B20) U13.2(~{WR})
PIT_A0: R87.1 U5.37(B11) U14.22(A0)
PIT_A1: R90.1 U5.36(B12) U14.23(A1)
PIT_CLK0: R69.1 U5.43(B5) U14.10(CLK0)
PIT_CLK1: R72.1 U5.42(B6) U14.18(CLK1)
PIT_CLK2: R75.1 U5.41(B7) U14.21(CLK2)
PIT_CS: R78.1 U5.40(B8) U14.24(CS#)
PIT_GATE0: R93.1 U5.35(B13) U14.13(GATE0)
PIT_GATE1: R96.1 U5.34(B14) U14.17(GATE1)
PIT_GATE2: R99.1 U5.33(B15) U14.19(GATE2)
PIT_OUT0: R102.1 U5.32(B16) U14.12(OUT0)
PIT_OUT1: R105.1 U5.31(B17) U14.16(OUT1)
PIT_OUT2: R108.1 U5.30(B18) U14.20(OUT2)
PIT_RD: R81.1 U5.39(B9) U14.26(RD#)
PIT_WR: R84.1 U5.38(B10) U14.27(WR#)
SD_CLK: CN1.5(CLK/SPI_SCLK) R134.1 U4.126(IO_K12)
SD_CMD: CN1.3(CMD/SPI_DI) R135.1 U4.127(IO_J14)
SD_DAT0: CN1.7(DAT0/SPI_DO) R133.1 U4.125(IO_L13)
SD_DAT1: CN1.8(DAT1) R132.1 U4.124(IO_L14)
SD_DAT2: CN1.1(DAT2) R137.1 U4.129(IO_J12)
SD_DAT3: CN1.2(DAT3/SPI_CS) R136.1 U4.128(IO_K11)
SPI_CLK: U4.123(IO_L12) U8.6(CLK)
SPI_CS: R128.1 U4.131(IO_K10) U8.1(~{CS})
SPI_DI: U4.122(IO_M12) U8.5(DI)
SPI_DO: U4.130(IO_J11) U8.2(DO)
SRAM_CE#: R11.1 U2.42(B6) U11.6(CE#)
SRAM_LB#: R17.1 U2.40(B8) U11.39(LB#)
SRAM_OE#: R5.1 U2.44(B4) U11.41(OE#)
SRAM_UB#: R14.1 U2.41(B7) U11.40(UB#)
SRAM_WE#: R8.1 U2.43(B5) U11.17(WE#)
TCK: J1.1 U4.150(TCK)
TDI: J1.9 U4.149(TDI)
TDO: J1.3 U4.3(TDO)
TMS: J1.5 U4.154(TMS)
UART_RX: P1.3 U4.132(IO_L10)
UART_TX: P1.2 U4.133(IO_K9)
NetCN1_9: CN1.9(CD) R131.1
NetLED1_1: LED1.1(A) R127.2
NetLED2_1: LED2.1(A) R140.2
NetR1_1: R1.1 U1.47(B1) U1.48(GATE)
NetR2_1: R2.1 U2.47(B1) U2.48(GATE)
NetR3_1: R3.1 U3.47(B1) U3.48(GATE)
NetR64_1: R64.1 RST_n1.2 U4.29(CLK_M1)
NetR65_1: R65.1 U5.47(B1) U5.48(GATE)
NetR66_1: R66.1 U6.47(B1) U6.48(GATE)
NetR67_1: R67.1 U7.47(B1) U7.48(GATE)
NetR129_1: R129.1 U8.7(~{HOLD})
NetR130_1: R130.1 U8.3(~{WP})

Not connected (* = marked no-connect by the designer): J1 6 7* 8*; J2 2(D-)* 3(D+)* 4(ID)*; S1 2 4 5 6; U1 3(A2)* 4(A3)* 45(B3)* 46(B2)*; U2 3(A2)* 4(A3)* 45(B3)* 46(B2)*; U3 3(A2)* 4(A3)* 45(B3)* 46(B2)*; U4 30(CLK_M2)* 94(CLK_M15)* 95(CLK_M16)* 110(CLK_E16)* 111(CLK_E15)*; U5 3(A2)* 4(A3)* 45(B3)* 46(B2)*; U6 3(A2)* 4(A3)* 45(B3)* 46(B2)*; U7 3(A2)* 4(A3)* 24(A23)* 25(B23)* 45(B3)* 46(B2)*; U9 20(NC)* 27(NC)* 29(NC)* 30(NC)* 31(NC)* 43(NC)* 44(NC)* 45(NC)* 46(NC)* 47(NC)*; U10 5(NC)* 7(NC)* 8(NC)* 17(NC)* 29(NC)*; U13 12(CAS0)* 13(CAS1)* 15(CAS2)*; U14 1(NC)* 11(NC)* 15(NC)* 25(NC)*

### Notes on the sheet
- FPGA CORE
- VOLTAGE CLAMP
- (near RST_n1) 复位键
- JTAG
- NAND FLASH
- SRAM
- CPU 80386
- DMA
- POWER
- PIC
- PIT
- Micro SD
- (in symbol EP4CE6/10_FPGACore) EP4CE6/10 FPGA_Core; PIN IO * 130; PIN CLK * 6; PIN JTAG * 5; PIN 3.3V * 4; PIN 2.5V * 1; PIN GND * 8

### Library data of the parts
C3 C5 C6 C9 C11 C12 C16-C18 C22-C25 C28-C31 C34 C35 C37 C39 C42-C51 = Cap: Capacitor; Published: 8-Jun-2000; LatestRevisionDate: 17-Jul-2002; LatestRevisionNote: Re-released for DXP Platform.; PackageReference: RAD-0.3; Publisher: Altium Limited; PackageDescription: Radial Cap, Thru-Hole; 2 Leads; 0.3 in Pin Spacing; Value: 104
C26 C27 C36 C38 C40 C41 = Cap Pol: 极性电解电容; Published: 8-Jun-2000; LatestRevisionDate: 17-Jul-2002; LatestRevisionNote: Re-released for DXP Platform.; PackageReference: RB7.6-15; Publisher: Altium Limited
C32 C33 = Cap Pol1: Polarized Capacitor (Radial); Published: 8-Jun-2000; LatestRevisionDate: 17-Jul-2002; LatestRevisionNote: Re-released for DXP Platform.; PackageReference: RB7.6-15; Publisher: Altium Limited; PackageDescription: Polarized Capacitor (Radial); 2 Leads
CN1 = Micro SD卡座
J1 = JTAG-10_Dup1
J2 = USB_M: MicroUSB接口
LED1 LED2 = LED0: 发光二极管; Published: 8-Jun-2000; LatestRevisionDate: 08-Jul-2005; LatestRevisionNote: Mech Layer 1 removed.; PackageReference: LED-0; Publisher: Altium Limited
P1 = Header 4: Header, 4-Pin; LatestRevisionDate: 17-Jul-2002; LatestRevisionNote: Re-released for DXP Platform.; Publisher: Altium Limited
R1-R126 R128-R139 = Res1: Resistor; Published: 8-Jun-2000; LatestRevisionDate: 17-Jul-2002; LatestRevisionNote: Re-released for DXP Platform.; PackageReference: AXIAL-0.3; Publisher: Altium Limited; PackageDescription: Axial Device, Thru-Hole; 2 Leads; 0.3 in Pin Spacing
R127 R140 = Res1: 贴片电阻; Published: 8-Jun-2000; LatestRevisionDate: 17-Jul-2002; LatestRevisionNote: Re-released for DXP Platform.; PackageReference: AXIAL-0.4; Publisher: Altium Limited
RST_n1 = SW-PB: Switch; Published: 24-Mar-1999; LatestRevisionDate: 17-Jul-2002; LatestRevisionNote: Re-released for DXP Platform.; PackageReference: SPST-2; Publisher: Altium Limited; PackageDescription: Switch; 2 Leads
S1 = SW-DPDT: Double-Pole, Double-Throw Switch; Published: 24-Mar-1999; LatestRevisionDate: 17-Jul-2002; LatestRevisionNote: Re-released for DXP Platform.; PackageReference: DPDT-6; Publisher: Altium Limited; PackageDescription: Switch; 6 Leads
U8 = W25QXX: SPI FLASH
U9 = Intel386sx: CPU-80386
U10 = IS82C37A: DMA控制器
U12 = ASM1117: 3.3V稳压芯片
U13 = P8259A: 中断控制器
U14 = CS82C54: Timer 定时器